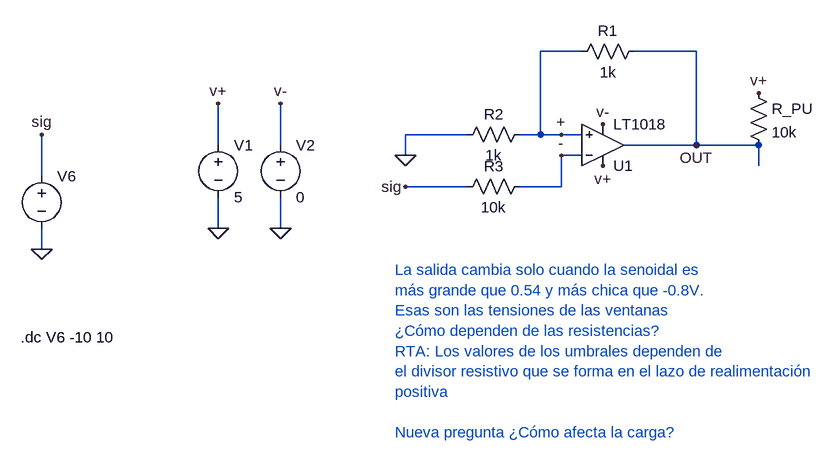
[diagram p0: schematic schmitt_trigger.asc]
schmitt_trigger.asc, the LTspice schematic file:
Version 4
SHEET 1 880 680
WIRE 192 -32 128 -32
WIRE 368 -32 272 -32
WIRE 16 96 -80 96
WIRE 128 96 128 -32
WIRE 128 96 96 96
WIRE 160 96 128 96
WIRE 192 96 160 96
WIRE -368 112 -368 48
WIRE -272 112 -272 48
WIRE 368 112 368 -32
WIRE 368 112 256 112
WIRE 464 112 368 112
WIRE -80 128 -80 96
WIRE 192 128 160 128
WIRE 464 144 464 112
WIRE -640 160 -640 96
WIRE 16 176 -80 176
WIRE 160 176 160 128
WIRE 160 176 96 176
WIRE -368 240 -368 192
WIRE -272 240 -272 192
WIRE -640 272 -640 240
FLAG -272 240 0
FLAG -368 240 0
FLAG -368 48 v+
FLAG 224 144 v+
FLAG -272 48 v-
FLAG 224 80 v-
FLAG -80 128 0
FLAG 160 96 +
FLAG 160 128 -
FLAG -640 272 0
FLAG -80 176 sig
FLAG 368 112 OUT
FLAG -640 96 sig
FLAG 464 32 v+
SYMBOL Comparators\\LT1018 224 112 M180
SYMATTR InstName U1
SYMBOL voltage -368 96 R0
WINDOW 123 0 0 Left 0
WINDOW 39 0 0 Left 0
SYMATTR InstName V1
SYMATTR Value 5
SYMBOL voltage -272 96 R0
WINDOW 123 0 0 Left 0
WINDOW 39 0 0 Left 0
SYMATTR InstName V2
SYMATTR Value 0
SYMBOL res 288 -48 R90
WINDOW 0 0 56 VBottom 2
WINDOW 3 32 56 VTop 2
SYMATTR InstName R1
SYMATTR Value 1k
SYMBOL res 112 80 R90
WINDOW 0 0 56 VBottom 2
WINDOW 3 32 56 VTop 2
SYMATTR InstName R2
SYMATTR Value 1k
SYMBOL res 112 160 R90
WINDOW 0 0 56 VBottom 2
WINDOW 3 32 56 VTop 2
SYMATTR InstName R3
SYMATTR Value 10k
SYMBOL voltage -640 144 R0
WINDOW 123 0 0 Left 0
WINDOW 39 0 0 Left 0
SYMATTR InstName V6
SYMATTR Value ""
SYMBOL res 448 16 R0
SYMATTR InstName R_PU
SYMATTR Value 10k
TEXT -96 304 Left 2 ;La salida cambia solo cuando la senoidal es\nmás grande que 0.54 y más chica que -0.8V.\nEsas son las tensiones de las ventanas\n¿Cómo dependen de las resistencias?\nRTA: Los valores de los umbrales dependen de\nel divisor resistivo que se forma en el lazo de realimentación\npositiva\n \nNueva pregunta ¿Cómo afecta la carga?
TEXT -672 408 Left 2 !.dc V6 -10 10

The netlist it stands for:
* schmitt_trigger.asc
XU1 + - v+ v- OUT LT1018  ; pins In+ In- V+ V- OUT
V1 v+ 0 5
V2 v- 0 0
R1 OUT + 1k
R2 + 0 1k
R3 - sig 10k
V6 sig 0
R_PU v+ OUT 10k
* La salida cambia solo cuando la senoidal es
* más grande que 0.54 y más chica que -0.8V.
* Esas son las tensiones de las ventanas
* ¿Cómo dependen de las resistencias?
* RTA: Los valores de los umbrales dependen de
* el divisor resistivo que se forma en el lazo de realimentación
* positiva
* Nueva pregunta ¿Cómo afecta la carga?
.dc V6 -10 10
.lib LTC1.lib
.backanno
.end